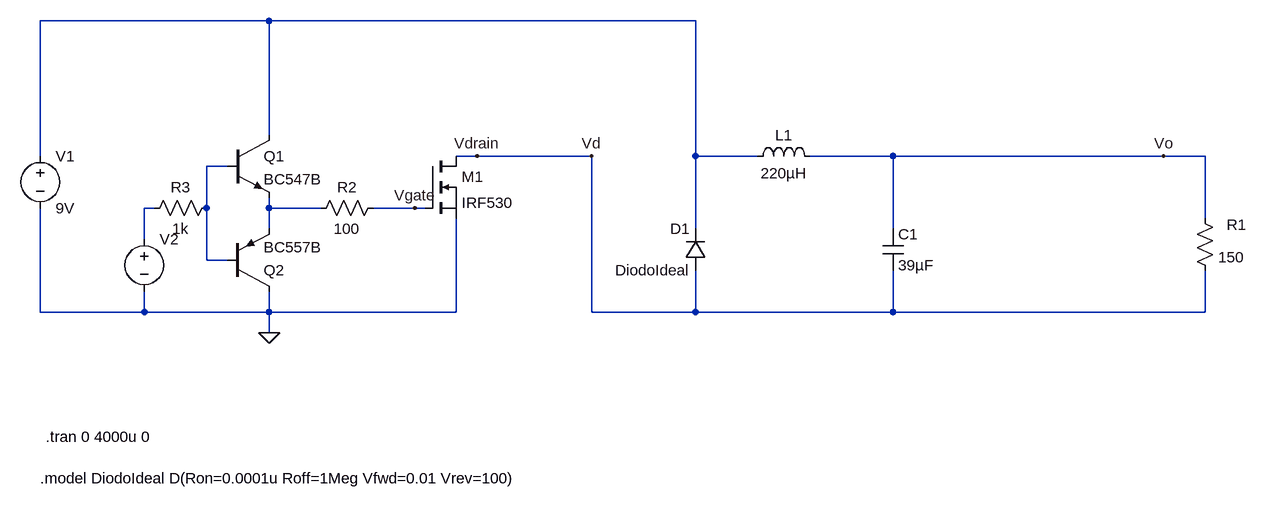
[diagram p0: schematic Punto 3 (Fuente Buck).asc]
Punto 3 (Fuente Buck).asc, the LTspice schematic file:
Version 4
SHEET 1 1852 900
WIRE 336 80 -16 80
WIRE 992 80 336 80
WIRE 336 256 336 80
WIRE -16 288 -16 80
WIRE 656 288 624 288
WIRE 832 288 656 288
WIRE 992 288 992 80
WIRE 1088 288 992 288
WIRE 1296 288 1168 288
WIRE 1712 288 1296 288
WIRE 1776 288 1712 288
WIRE 272 304 240 304
WIRE 160 368 144 368
WIRE 240 368 240 304
WIRE 336 368 336 352
WIRE 416 368 336 368
WIRE 560 368 496 368
WIRE 576 368 560 368
WIRE 1776 384 1776 288
WIRE 336 400 336 368
WIRE 992 400 992 288
WIRE 1296 400 1296 288
WIRE 144 416 144 368
WIRE 240 448 240 368
WIRE 272 448 240 448
WIRE -16 528 -16 368
WIRE 144 528 144 496
WIRE 144 528 -16 528
WIRE 336 528 336 496
WIRE 336 528 144 528
WIRE 624 528 624 384
WIRE 624 528 336 528
WIRE 832 528 832 288
WIRE 992 528 992 464
WIRE 992 528 832 528
WIRE 1296 528 1296 464
WIRE 1296 528 992 528
WIRE 1776 528 1776 464
WIRE 1776 528 1296 528
WIRE 336 560 336 528
FLAG 1712 288 Vo
FLAG 832 288 Vd
FLAG 336 560 0
FLAG 656 288 Vdrain
FLAG 560 368 Vgate
SYMBOL voltage -16 272 R0
WINDOW 123 0 0 Left 0
WINDOW 39 0 0 Left 0
SYMATTR InstName V1
SYMATTR Value 9V
SYMBOL res 1760 368 R0
WINDOW 0 49 26 Left 2
SYMATTR InstName R1
SYMATTR Value 150
SYMBOL ind 1072 304 R270
WINDOW 0 32 56 VTop 2
WINDOW 3 5 56 VBottom 2
SYMATTR InstName L1
SYMATTR Value 220µH
SYMBOL cap 1280 400 R0
SYMATTR InstName C1
SYMATTR Value 39µF
SYMBOL diode 1008 464 R180
WINDOW 0 24 64 Left 2
WINDOW 3 24 0 Left 2
SYMATTR InstName D1
SYMATTR Value DiodoIdeal
SYMBOL voltage 144 400 R0
WINDOW 3 24 96 Invisible 2
WINDOW 123 0 0 Left 0
WINDOW 39 0 0 Left 0
SYMATTR Value PULSE(0 15 1n 1n 1n 9.674u 20u)
SYMATTR InstName V2
SYMBOL npn 272 256 R0
SYMATTR InstName Q1
SYMATTR Value BC547B
SYMBOL pnp 272 496 M180
SYMATTR InstName Q2
SYMATTR Value BC557B
SYMBOL nmos 576 288 R0
SYMATTR InstName M1
SYMATTR Value IRF530
SYMBOL res 512 352 R90
WINDOW 0 0 56 VBottom 2
WINDOW 3 32 56 VTop 2
SYMATTR InstName R2
SYMATTR Value 100
SYMBOL res 256 352 R90
WINDOW 0 0 56 VBottom 2
WINDOW 3 32 56 VTop 2
SYMATTR InstName R3
SYMATTR Value 1k
TEXT -8 720 Left 2 !.tran 0 4000u 0
TEXT -16 784 Left 2 !.model DiodoIdeal D(Ron=0.0001u Roff=1Meg Vfwd=0.01 Vrev=100)

The netlist it stands for:
* Punto 3 (Fuente Buck).asc
V1 N001 0 9V
R1 Vo Vdrain 150
L1 N001 Vo 220µH
C1 Vo Vdrain 39µF
D1 Vdrain N001 DiodoIdeal
V2 N003 0 PULSE(0 15 1n 1n 1n 9.674u 20u)
Q1 N001 N002 N004 0 BC547B
Q2 0 N002 N004 0 BC557B
M1 Vdrain Vgate 0 0 IRF530
R2 Vgate N004 100
R3 N002 N003 1k
.model D D
.lib standard.dio
.model NPN NPN
.model PNP PNP
.lib standard.bjt
.model NMOS NMOS
.model PMOS PMOS
.lib standard.mos
.tran 0 4000u 0
.model DiodoIdeal D(Ron=0.0001u Roff=1Meg Vfwd=0.01 Vrev=100)
.backanno
.end